# Altium schematic sheet Sheet1.SchDoc
size Tabloid; SheetNumber: 1; SheetTotal: 1
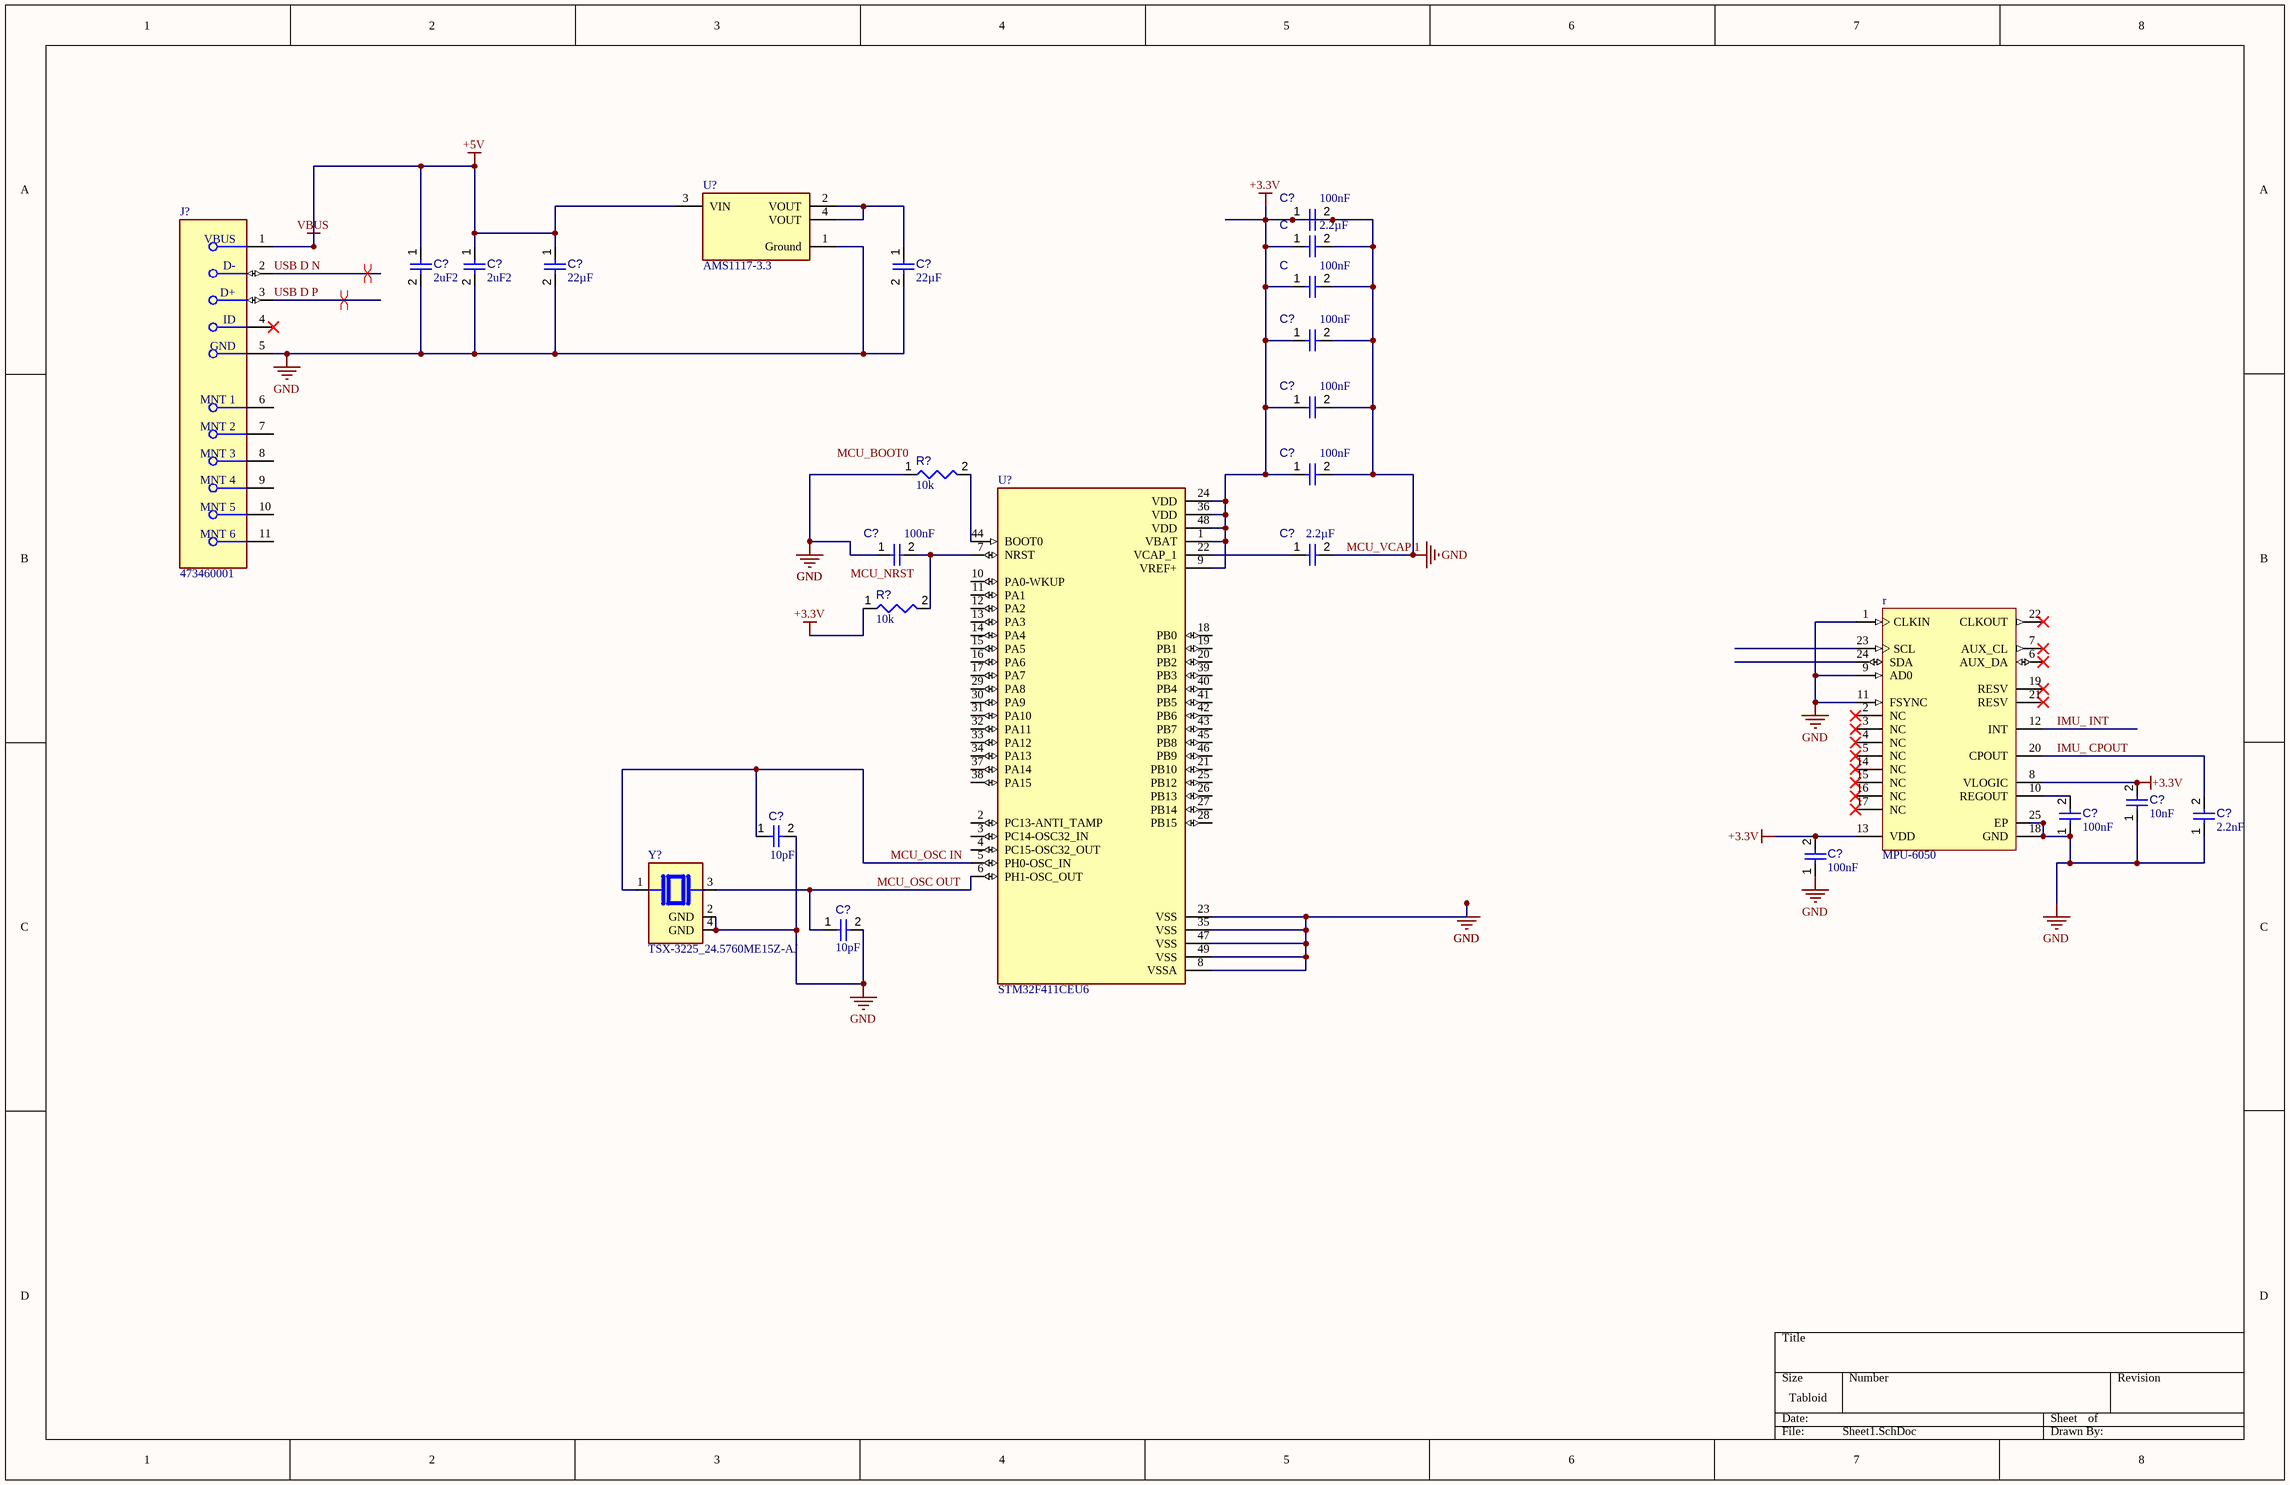
[diagram p0: Sheet1.SchDoc]

## Parts
(Parts that share a designator on the sheet are numbered #1, #2 ... from top to bottom, then left to right.)
C#1  value 2.2µF  [CAPC1608X94X35NL15T15]  (hidden comment: Capacitor 1 uF +/- 10% 16 V 0603)
C#2  value 100nF  [CAPC1005X56X25NL10T15]  (hidden comment: Capacitor 6.8 nF +/- 10% 16 V 0402)
C?#1  value 100nF  [CAPC1005X56X25NL10T15]  (hidden comment: Capacitor 6.8 nF +/- 10% 16 V 0402)
C?#2  value 2uF2  [CAPC1005X56X25NL10T15]  (hidden comment: Capacitor 6.8 nF +/- 10% 16 V 0402)
C?#3  value 2uF2  [CAPC1005X56X25NL10T15]  (hidden comment: Capacitor 6.8 nF +/- 10% 16 V 0402)
C?#4  value 22µF  [CAPC2013X135X45NL10T25]  (hidden comment: Capacitor 10 uF +/- 10% 16 V 0805)
C?#5  value 22µF  [CAPC2013X135X45NL10T25]  (hidden comment: Capacitor 10 uF +/- 10% 16 V 0805)
C?#6  value 100nF  [CAPC1005X56X25NL10T15]  (hidden comment: Capacitor 6.8 nF +/- 10% 16 V 0402)
C?#7  value 100nF  [CAPC1005X56X25NL10T15]  (hidden comment: Capacitor 6.8 nF +/- 10% 16 V 0402)
C?#8  value 100nF  [CAPC1005X56X25NL10T15]  (hidden comment: Capacitor 6.8 nF +/- 10% 16 V 0402)
C?#9  value 100nF  [CAPC1005X56X25NL10T15]  (hidden comment: Capacitor 6.8 nF +/- 10% 16 V 0402)
C?#10  value 2.2µF  [CAPC1608X94X35NL15T15]  (hidden comment: Capacitor 1 uF +/- 10% 16 V 0603)
C?#11  value 10nF  [CAPC1005X56X25NL10T15]  (hidden comment: Capacitor 6.8 nF +/- 10% 16 V 0402)
C?#12  value 10pF  [CAPC1005X56X25NL10T15]  (hidden comment: Capacitor 6.8 nF +/- 10% 16 V 0402)
C?#13  value 100nF  [CAPC1005X56X25NL10T15]  (hidden comment: Capacitor 6.8 nF +/- 10% 16 V 0402)
C?#14  value 2.2nF  [CAPC1005X56X25NL10T15]  (hidden comment: Capacitor 6.8 nF +/- 10% 16 V 0402)
C?#15  value 100nF  [CAPC1005X56X25NL10T15]  (hidden comment: Capacitor 6.8 nF +/- 10% 16 V 0402)
C?#16  value 10pF  [CAPC1005X56X25NL10T15]  (hidden comment: Capacitor 6.8 nF +/- 10% 16 V 0402)
J?  473460001  [FP-473460001-MFG]
r  MPU-6050  [IS-QFN-24_V]
R?#1  value 10k  [RESC0402(1005)_L]  (hidden comment: 10KR2F)
R?#2  value 10k  [RESC0402(1005)_L]  (hidden comment: 10KR2F)
U?#1  AMS1117-3.3  [FP-AMS1117-IPC_C]
U?#2  STM32F411CEU6  [QFN50P700X700X60-49N]
Y?  TSX-3225_24.5760ME15Z-AJ  [XTAL_TSX-3225_24.5760ME15Z-AJ]

## Nets
+5V: C?#2.1 C?#3.1 C?#4.1 J?.1(VBUS) U?#1.3(VIN)  [also labelled VBUS]
MCU_VCAP 1: C#1.1 C#1.2 C#2.1 C#2.2 C?#1.1 C?#1.2 C?#2.2 C?#3.2 C?#4.2 C?#5.2 C?#6.1 C?#6.2 C?#7.1 C?#7.2 C?#8.1 C?#8.2 C?#9.1 C?#10.2 C?#11.1 C?#11.2 C?#12.2 C?#13.1 C?#14.1 C?#15.1 C?#15.2 C?#16.2 J?.5(GND) r.1(CLKIN) r.8(VLOGIC) r.9(AD0) r.11(FSYNC) r.13(VDD) r.18(GND) r.25(EP) R?#1.1 R?#2.1 U?#1.1(Ground) U?#2.1(VBAT) U?#2.8(VSSA) U?#2.9(VREF+) U?#2.23(VSS) U?#2.24(VDD) U?#2.35(VSS) U?#2.36(VDD) U?#2.47(VSS) U?#2.48(VDD) U?#2.49(VSS) Y?.2(GND) Y?.4(GND)  [also labelled +3.3V, GND]
IMU_ CPOUT: C?#14.2 r.20(CPOUT)
IMU_ INT: r.12(INT)
MCU_OSC IN: C?#12.1 U?#2.5(PH0-OSC_IN) Y?.1
MCU_OSC OUT: C?#16.1 U?#2.6(PH1-OSC_OUT) Y?.3
USB D N: J?.2(D-)
USB D P: J?.3(D+)
NetC?#5_1: C?#5.1 U?#1.2(VOUT) U?#1.4(VOUT)
NetC?#9_2: C?#9.2 R?#2.2 U?#2.7(NRST)
NetC?#10_1: C?#10.1 U?#2.22(VCAP_1)
NetC?#13_2: C?#13.2 r.10(REGOUT)
NetR?#1_2: R?#1.2 U?#2.44(BOOT0)

Not connected (* = marked no-connect by the designer): J? 4(ID)* 6(MNT_1) 7(MNT_2) 8(MNT_3) 9(MNT_4) 10(MNT_5) 11(MNT_6); r 2(NC)* 3(NC)* 4(NC)* 5(NC)* 6(AUX_DA)* 7(AUX_CL)* 14(NC)* 15(NC)* 16(NC)* 17(NC)* 19(RESV)* 21(RESV)* 22(CLKOUT)* 23(SCL) 24(SDA); U?#2 2(PC13-ANTI_TAMP) 3(PC14-OSC32_IN) 4(PC15-OSC32_OUT) 10(PA0-WKUP) 11(PA1) 12(PA2) 13(PA3) 14(PA4) 15(PA5) 16(PA6) 17(PA7) 18(PB0) 19(PB1) 20(PB2) 21(PB10) 25(PB12) 26(PB13) 27(PB14) 28(PB15) 29(PA8) 30(PA9) 31(PA10) 32(PA11) 33(PA12) 34(PA13) 37(PA14) 38(PA15) 39(PB3) 40(PB4) 41(PB5) 42(PB6) 43(PB7) 45(PB8) 46(PB9)

## Layout directives
differential pair: USB D N, USB D P

## Notes on the sheet
- Labels drawn without touching a wire or pin: MCU_BOOT0, MCU_NRST

## Library data of the parts
C#1 C?#10 = CMP-001-00003-6: Chip Capacitor, 1 uF, +/- 10%, 16 V, 0603 (1608 Metric); Voltage Rating: 16V; Capacitor Type: Ceramic; Max Operating Temperature: 125°C; Pins: 2; Tolerance: 10%; Min Operating Temperature: -55°C; RoHS Compliant: True; Mounting Technology: SM; Case/Package: 0603
C#2 C?#1-C?#3 C?#6-C?#9 C?#11-C?#16 = CMP-001-00000-6: Chip Capacitor, 6.8 nF, +/- 10%, 16 V, 0402 (1005 Metric); Capacitor Type: Ceramic; Voltage Rating: 16V; RoHS Compliant: True; Pins: 2; Case/Package: 0402; Min Operating Temperature: -55°C; Tolerance: 10%; Mounting Technology: SM; Max Operating Temperature: 125°C
C?#4 C?#5 = CMP-001-00015-6: Chip Capacitor, 10 uF, +/- 10%, 16 V, 0805 (2012 Metric); Voltage Rating: 16V; Capacitor Type: Ceramic; RoHS Compliant: True; Max Operating Temperature: 85°C; Min Operating Temperature: -55°C; Mounting Technology: SM; Tolerance: 10%; Case/Package: 0805; Pins: 2
J? = CMP-2000-05246-2: CONN RCPT USB2.0 MICRO B SMD R/A; Manufacturer: Molex; Conn Orientation: Right Angle; Is Female: yes; Shielding: true; Pitch: 0.65mm; Number Of Contacts: 5; Description: USB - micro B USB 2.0 Receptacle Connector 5 Position Surface Mount, Right Angle; Voltage Rating: 30V; Current Rating: 1.8A; Device Class L2: USB Connectors; Digikey Description: CONN RCPT USB2.0 MICRO B SMD R/A; Height: 2.945mm; RoHS: TRUE; ComponentLink2Description: Datasheet; Octopart: https://octopart.com/47346-0001-molex-7164928; Automotive: No; Package: 0; Category: Conn; Device Class L1: Connectors; Usb Standard: USB 2.0; Temperature: -30°C to +85°C; Temperature Range Low: -30°C; Footprint Url: https://www.molex.com/pdm_docs/sd/473460001_sd.pdf; ComponentLink2URL: https://www.molex.com/webdocs/datasheets/pdf/en-us/0473460001_IO_CONNECTORS.pdf; Lead Free: Yes; Manufacturer Part Number: 473460001; Contact Material: Gold,Nickel; Temperature Range High: +85°C; Device Class L3: unset
r = CMP-1753-00002-2: 3-Axis Gyroscope, Accelerometer and a Digital Motion Processor(TM) (DMP), 2.375 to 3.46 V, -40 to 85 degC, 24-Pin QFN, RoHS, Tape and Reel; Manufacturer: InvenSense; Featured Product: MPU-60506-Axis,IntegratedI²CSolution; Other Names: 1428-1007-2 / MPU6050; Sensor Type: MotionTracking; Online Catalog: MPU-6000™Series; Unit PriceUSD: Digital; Datasheet Version: Rev. 3.3, 05/2012; Category: Sensors,Transducers; Datasheet URL: http://datasheet.octopart.com/MPU-6050-InvenSense-datasheet-14421344.pdf; Family: Multifunction; Standard Package: 5,000; Manufacturer URL: http://www.invensense.com/; Output Type: Digital; Dynamic Catalog: MPU-6000™Series
R?#1 R?#2 = CMP-009-00066-2: 10K 0.063W 1% 0402 (1005 Metric)  SMD; Power: 63mW; Case/Package: 0402; Mounting Technology: SMT; Pins: 2; Tolerance: 1%
U?#1 = CMP-209535-000001-1: LDO Voltage Regulators 1A, 3.3V; Manufacturer: Advanced Monolithic Systems; Dropout Voltage: 1.1V; Output Type: Fixed; Nominal Supply Current: 5mA; Max Power Dissipation: 1.2W; Max Supply Voltage: 15V; Number Of Outputs: 1; Standoff Height: 0.64mm; Max Junction Temp: +125°C; Height: 1.8mm; Package: AMS1117; Device Class L2: Power Management ICs; ComponentLink2Description: Datasheet; ComponentLink2URL: http://www.advanced-monolithic.com/pdf/ds1117.pdf; Category: IC; RoHS: TRUE; Automotive: No; Device Class L1: Integrated Circuits (ICs); Output Current: 1A; Device Class L3: Voltage Regulators - Linear; Temperature: -40°C to +125°C; Output Voltage: 3.3V; Manufacturer Part Number: AMS1117-3.3; Temperature Range Low: -40°C; Octopart: https://octopart.com/ams1117-3.3-advanced+monolithic+systems-25899300; Lead Free: Yes; Ipc Land Pattern Name: SOT229P700X180-4; Temperature Range High: +125°C
U?#2 = STM32F411CEU6: High-performance access line, ARM Cortex-M4 core with DSP and FPU, 512 Kbytes Flash, 100 MHz CPU, ART Accelerator; Package: None; Availability: Unavailable; Value: *; MP: STM32F411CEU6; Price: None
Y? = TSX-3225_24.5760ME15Z-AJ: CRYSTAL 24.5760MHZ 8PF SMD; MF: EPSON; MP: TSX-3225 24.5760ME15Z-AJ; SnapEDA_Link: https://www.snapeda.com/parts/TSX-3225%2024.5760ME15Z-AJ/Epson/view-part/?ref=snap; Package: NON STANDARD-4 EPSON; Value: *; Check_prices: https://www.snapeda.com/parts/TSX-3225%2024.5760ME15Z-AJ/Epson/view-part/?ref=eda